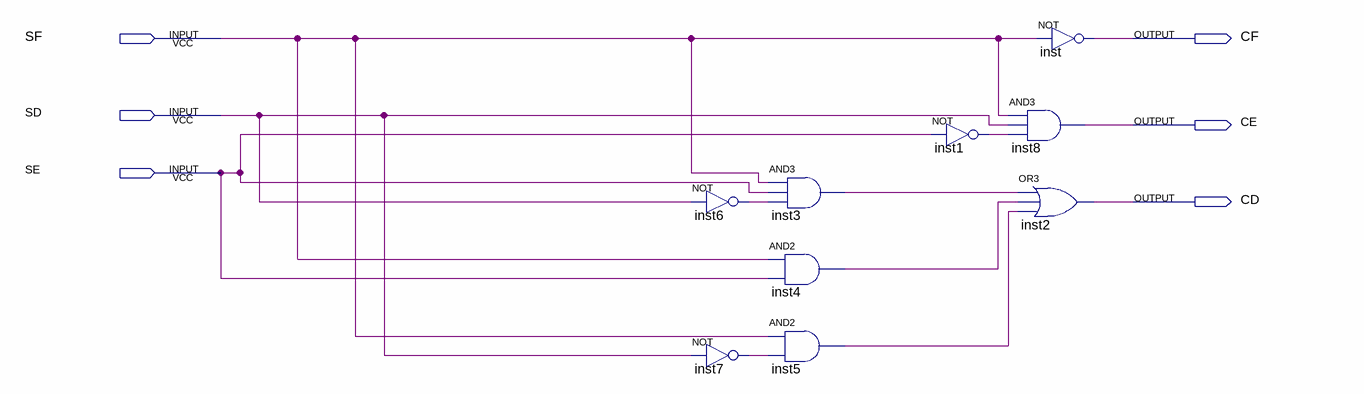
[diagram p0: schematic sheet]
// Quartus schematic Aula4.bdf as structural Verilog: 9 symbols, 6 pins
module Aula4 (
  input  SF,
  input  SD,
  input  SE,
  output CF,
  output CE,
  output CD
);

  wire inst1_out, inst3_out, inst4_out, inst5_out, inst6_out, inst7_out;

  not inst6 (inst6_out, SD);
  not inst7 (inst7_out, SD);
  and inst3 (inst3_out, SF, SE, inst6_out);
  and inst4 (inst4_out, SF, SE);
  and inst5 (inst5_out, SF, inst7_out);
  not inst1 (inst1_out, SE);
  not inst (CF, SF);
  and inst8 (CE, SF, SD, inst1_out);
  or inst2 (CD, inst3_out, inst4_out, inst5_out);
endmodule
